# Altium schematic sheet v0.SchDoc
size B
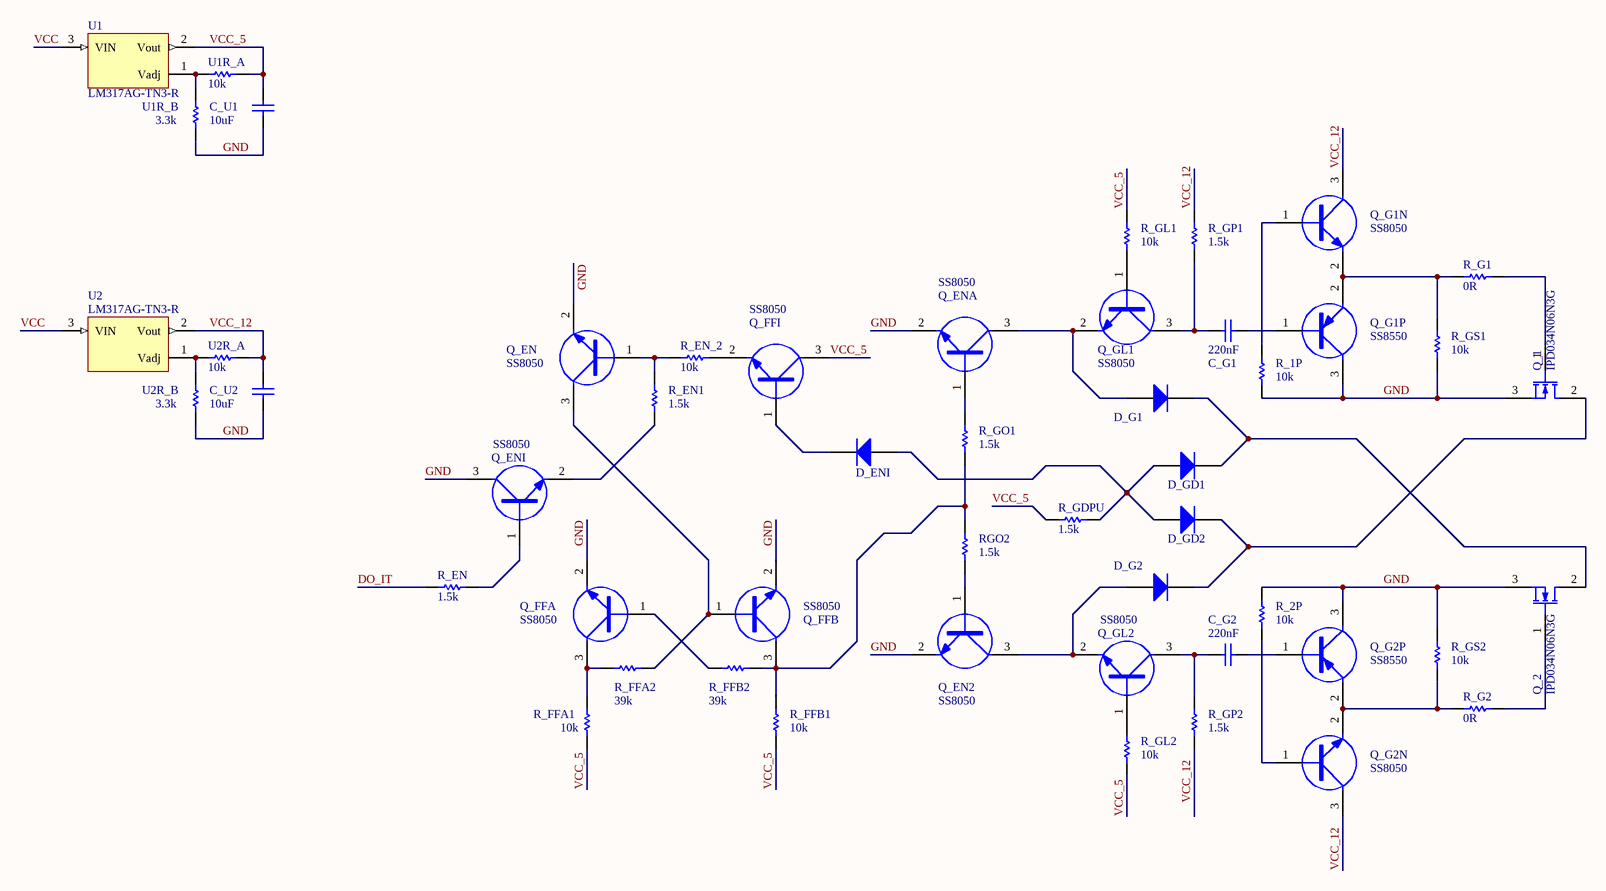
[diagram p0: v0.SchDoc]

## Parts
C_G1  value 220nF  [CAP 0402]  (hidden comment: CL05B224KO5NNNC)
C_G2  value 220nF  [CAP 0402]  (hidden comment: CL05B224KO5NNNC)
C_U1  value 10uF  [CAP 0805]  (hidden comment: CL21A106KAYNNNE)
C_U2  value 10uF  [CAP 0805]  (hidden comment: CL21A106KAYNNNE)
D_ENI  N4148WS  [sod-323]  (value not drawn)
D_G1  N4148WS  [sod-323]  (value not drawn)
D_G2  N4148WS  [sod-323]  (value not drawn)
D_GD1  N4148WS  [sod-323]  (value not drawn)
D_GD2  N4148WS  [sod-323]  (value not drawn)
Q_1  IPD034N06N3G  [to-252-2]
Q_2  IPD034N06N3G  [to-252-2]
Q_EN  SS8050  [SOT-23-3]
Q_EN2  SS8050  [SOT-23-3]
Q_ENA  SS8050  [SOT-23-3]
Q_ENI  SS8050  [SOT-23-3]
Q_FFA  SS8050  [SOT-23-3]
Q_FFB  SS8050  [SOT-23-3]
Q_FFI  SS8050  [SOT-23-3]
Q_G1N  SS8050  [SOT-23-3]
Q_G1P  SS8550  [SOT-23-3]
Q_G2N  SS8050  [SOT-23-3]
Q_G2P  SS8550  [SOT-23-3]
Q_GL1  SS8050  [SOT-23-3]
Q_GL2  SS8050  [SOT-23-3]
R_1P  value 10k  [RES 0402]  (hidden comment: 0402WGF1002TCE)
R_2P  value 10k  [RES 0402]  (hidden comment: 0402WGF1002TCE)
R_EN  value 1.5k  [RES 0402]  (hidden comment: 0402WGF1501TCE)
R_EN1  value 1.5k  [RES 0402]  (hidden comment: 0402WGF1501TCE)
R_EN_2  value 10k  [RES 0402]  (hidden comment: 0402WGF1002TCE)
R_FFA1  value 10k  [RES 0402]  (hidden comment: 0402WGF1002TCE)
R_FFA2  value 39k  [RES 0402]  (hidden comment: 0402WGF3902TCE)
R_FFB1  value 10k  [RES 0402]  (hidden comment: 0402WGF1002TCE)
R_FFB2  value 39k  [RES 0402]  (hidden comment: 0402WGF3902TCE)
R_G1  value 0R  [RES 0402]  (hidden comment: 0402WGF0000TCE)
R_G2  value 0R  [RES 0402]  (hidden comment: 0402WGF0000TCE)
R_GDPU  value 1.5k  [RES 0402]  (hidden comment: 0402WGF1501TCE)
R_GL1  value 10k  [RES 0402]  (hidden comment: 0402WGF1002TCE)
R_GL2  value 10k  [RES 0402]  (hidden comment: 0402WGF1002TCE)
R_GO1  value 1.5k  [RES 0402]  (hidden comment: 0402WGF1501TCE)
R_GP1  value 1.5k  [RES 0402]  (hidden comment: 0402WGF1501TCE)
R_GP2  value 1.5k  [RES 0402]  (hidden comment: 0402WGF1501TCE)
R_GS1  value 10k  [RES 0402]  (hidden comment: 0402WGF1002TCE)
R_GS2  value 10k  [RES 0402]  (hidden comment: 0402WGF1002TCE)
RGO2  value 1.5k  [RES 0402]  (hidden comment: 0402WGF1501TCE)
U1  LM317AG-TN3-R  [TO-252-2]
U1R_A  value 10k  [RES 0402]  (hidden comment: 0402WGF1002TCE)
U1R_B  value 3.3k  [RES 0402]  (hidden comment: 0402WGF3301TCE)
U2  LM317AG-TN3-R  [TO-252-2]
U2R_A  value 10k  [RES 0402]  (hidden comment: 0402WGF1002TCE)
U2R_B  value 3.3k  [RES 0402]  (hidden comment: 0402WGF3301TCE)

## Nets
DO_IT: R_EN.2
GND: C_U1.1 C_U2.1 Q_1.3(S) Q_2.3(S) Q_EN.2(E) Q_EN2.2(E) Q_ENA.2(E) Q_ENI.3(C) Q_FFA.2(E) Q_FFB.2(E) Q_G1P.3(C) Q_G2P.3(C) R_1P.1 R_2P.2 R_GS1.1 R_GS2.2 U1R_B.1 U2R_B.1
VCC: U1.3(VIN) U2.3(VIN)
VCC_5: C_U1.2 Q_FFI.3(C) R_FFA1.2 R_FFB1.2 R_GDPU.2 R_GL1.2 R_GL2.1 U1.2(Vout) U1R_A.1
VCC_12: C_U2.2 Q_G1N.3(C) Q_G2N.3(C) R_GP1.2 R_GP2.1 U2.2(Vout) U2R_A.1
NetC_G1_1: C_G1.1 Q_GL1.3(C) R_GP1.1
NetC_G1_2: C_G1.2 Q_G1P.1(B)
NetC_G2_1: C_G2.1 Q_GL2.3(C) R_GP2.2
NetC_G2_2: C_G2.2 Q_G2P.1(B)
NetD_ENI_1: D_ENI.1(K) Q_FFI.1(B)
NetD_ENI_2: D_ENI.2(A) D_GD1.2(A) D_GD2.2(A) R_GDPU.1
NetD_G1_1: D_G1.1(K) D_GD1.1(K) Q_2.2(D)
NetD_G1_2: D_G1.2(A) Q_ENA.3(C) Q_GL1.2(E)
NetD_G2_1: D_G2.1(K) D_GD2.1(K) Q_1.2(D)
NetD_G2_2: D_G2.2(A) Q_EN2.3(C) Q_GL2.2(E)
NetQ_1_1: Q_1.1(G) R_G1.2
NetQ_2_1: Q_2.1(G) R_G2.2
NetQ_EN2_1: Q_EN2.1(B) RGO2.1
NetQ_EN_1: Q_EN.1(B) R_EN1.2 R_EN_2.2
NetQ_EN_3: Q_EN.3(C) Q_FFB.1(B) R_FFA2.2
NetQ_ENA_1: Q_ENA.1(B) R_GO1.2
NetQ_ENI_1: Q_ENI.1(B) R_EN.1
NetQ_ENI_2: Q_ENI.2(E) R_EN1.1
NetQ_FFA_1: Q_FFA.1(B) R_FFB2.1
NetQ_FFA_3: Q_FFA.3(C) R_FFA1.1 R_FFA2.1
NetQ_FFB_3: Q_FFB.3(C) R_FFB1.1 R_FFB2.2 R_GO1.1 RGO2.2
NetQ_FFI_2: Q_FFI.2(E) R_EN_2.1
NetQ_G1N_1: Q_G1N.1(B) R_1P.2
NetQ_G1N_2: Q_G1N.2(E) Q_G1P.2(E) R_G1.1 R_GS1.2
NetQ_G2N_1: Q_G2N.1(B) R_2P.1
NetQ_G2N_2: Q_G2N.2(E) Q_G2P.2(E) R_G2.1 R_GS2.1
NetQ_GL1_1: Q_GL1.1(B) R_GL1.1
NetQ_GL2_1: Q_GL2.1(B) R_GL2.2
NetU1_1: U1.1(Vadj) U1R_A.2 U1R_B.2
NetU2_1: U2.1(Vadj) U2R_A.2 U2R_B.2

## Library data of the parts
C_G1 C_G2 = CL05B224KO5NNNC: CAPACITOR MLCC - 220nF 16V 0402; WVDC: 16; LCSC Part #: C16772; JLC Availability: Basic
C_U1 C_U2 = CL21A106KAYNNNE: CAPACITOR MLCC - 10uF 25V 0805; WVDC: 25; LCSC Part #: C15850; Availability: Basic
D_ENI D_G1 D_G2 D_GD1 D_GD2 = N4148WS: DIODE - 100V 150MA 1.25V @ 150MA 4NS SOD-323; LCSC Part #: C2128; JLC Availability: Basic; PIV: 100V; If: 150mA; Trr: 4ns
Q_1 Q_2 = IPD034N06N3G: MOSFET (N) - TRENCH 60V 100A 4V @ 93UA 3.4 M? @ 100A,10V TO-252-2(DPAK) ROHS; LCSC Part #: C94897; JLC Availability: Extended
Q_EN Q_EN2 Q_ENA Q_ENI Q_FFA Q_FFB Q_FFI Q_G1N Q_G2N Q_GL1 Q_GL2 = SS8050: BJT NPN - 25V 1.5A; JLC Availability: Basic; LCSC Part #: C2150
Q_G1P Q_G2P = SS8550: BJT PNP - 25V 1.5A; JLC Availability: Basic; LCSC Part #: C8542
R_1P R_2P R_EN_2 R_FFA1 R_FFB1 R_GL1 R_GL2 R_GS1 R_GS2 U1R_A U2R_A = 0402WGF1002TCE: RESISTOR SMD - 10k 1% 0402; LCSC Part #: C25744; JLC Availability: Basic
R_EN R_EN1 R_GDPU R_GO1 R_GP1 R_GP2 RGO2 = 0402WGF1501TCE: RESISTOR SMD - 1.5k 1% 0402; LCSC Part #: C25867; JLC Availability: Basic
R_FFA2 R_FFB2 = 0402WGF3902TCE: RESISTOR SMD - 39k 1% 0402; LCSC Part #: C25783; JLC Availability: Basic
R_G1 R_G2 = 0402WGF0000TCE: RESISTOR SMD - 0R 1% 0402; LCSC Part #: C17168; JLC Availability: Basic
U1 U2 = LM317AG-TN3-R: IC - LDO; VOut: ADJ; LCSC Part #: C75510; JLC Availability: Basic
U1R_B U2R_B = 0402WGF3301TCE: RESISTOR SMD - 3.3k 1% 0402; LCSC Part #: C25890; JLC Availability: Basic